# Altium schematic sheet BBeams.SchDoc: Boosted Beams
size A4; Date: 4/20/2020; Author: Dawson Moore; DrawnBy: Dawson Moore; Engineer: Dawson Moore; Organization: Boosted Legacy; DocumentNumber: 1; Revision: 1.3; SheetNumber: 1; SheetTotal: 1
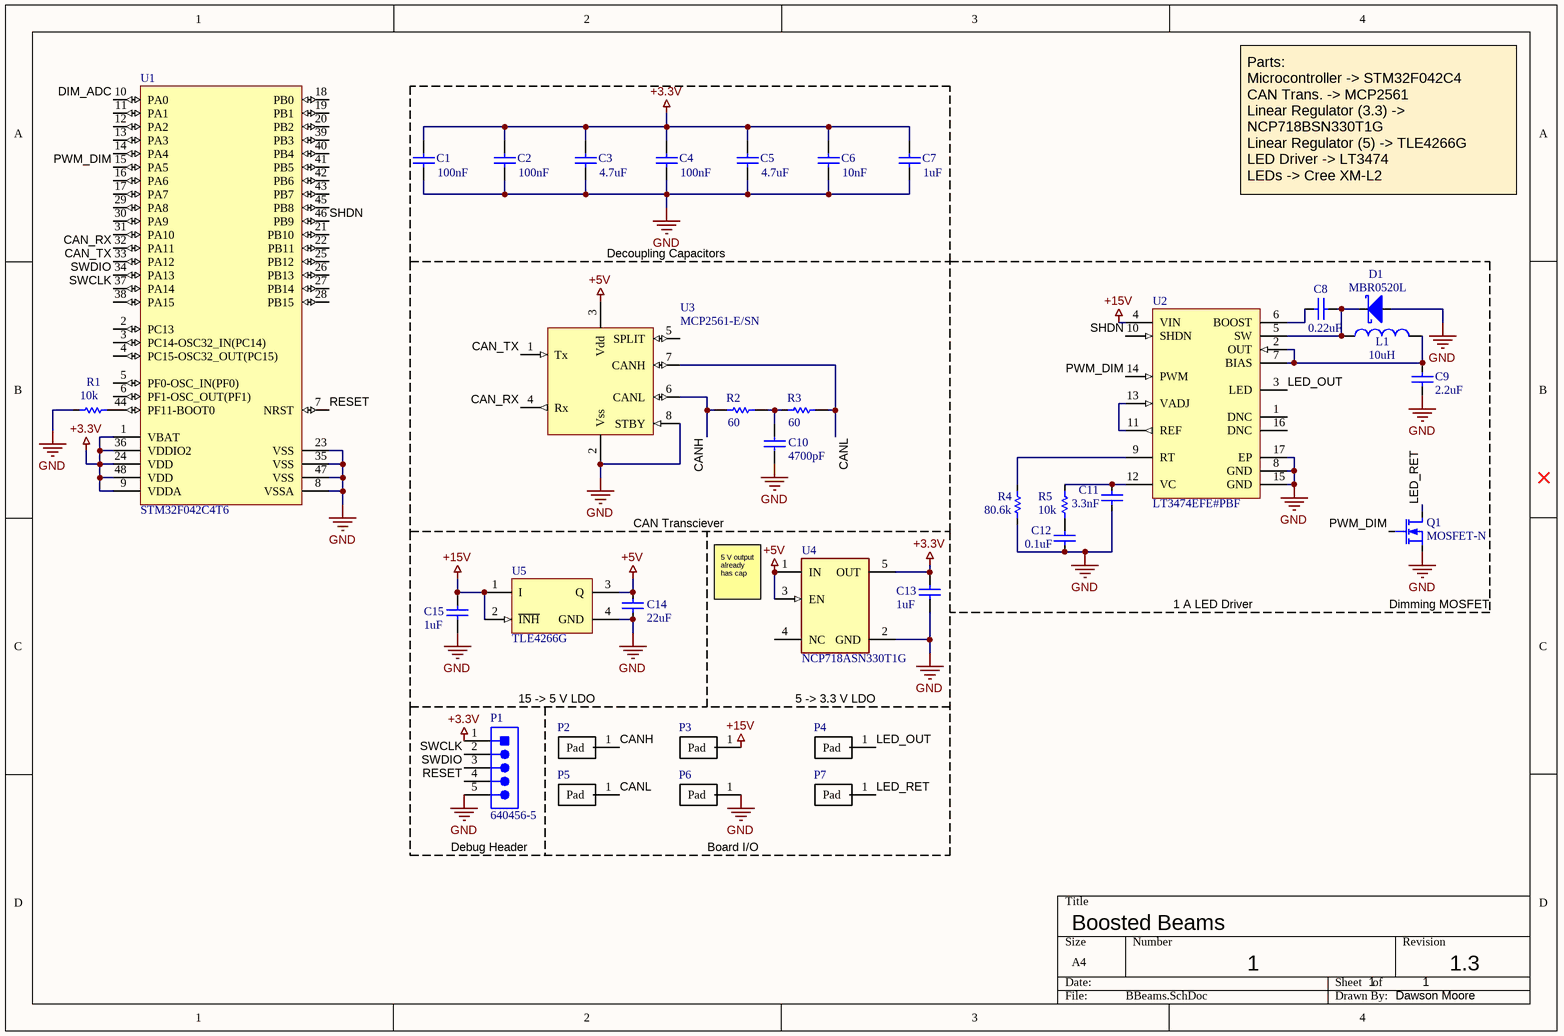
[diagram p0: BBeams.SchDoc]

## Parts
C1  value 100nF  [1608[0603]]  (hidden comment: Cap Semi)
C2  value 100nF  [1608[0603]]  (hidden comment: Cap Semi)
C3  value 4.7uF  [1608[0603]]  (hidden comment: Cap Semi)
C4  value 100nF  [1608[0603]]  (hidden comment: Cap Semi)
C5  value 4.7uF  [1608[0603]]  (hidden comment: Cap Semi)
C6  value 10nF  [1608[0603]]  (hidden comment: Cap Semi)
C7  value 1uF  [1608[0603]]  (hidden comment: Cap Semi)
C8  value 0.22uF  [1608[0603]]  (hidden comment: Cap Semi)
C9  value 2.2uF  [1608[0603]]  (hidden comment: Cap Semi)
C10  value 4700pF  [1608[0603]]  (hidden comment: Cap Semi)
C11  value 3.3nF  [1608[0603]]  (hidden comment: Cap Semi)
C12  value 0.1uF  [1608[0603]]  (hidden comment: Cap Semi)
C13  value 1uF  [1608[0603]]  (hidden comment: Cap Semi)
C14  value 22uF  [1608[0603]]  (hidden comment: Cap Semi)
C15  value 1uF  [1608[0603]]  (hidden comment: Cap Semi)
D1  MBR0520L  [ONSC-SOD-123-2-425-04_V]
L1  value 10uH  [1608[0603]]  (hidden comment: Inductor)
P1  640456-5  [TECO-640456-5]
P2  I/O Pad  [I/O Pad]  (value not drawn)
P3  I/O Pad  [I/O Pad]  (value not drawn)
P4  I/O Pad  [I/O Pad]  (value not drawn)
P5  I/O Pad  [I/O Pad]  (value not drawn)
P6  I/O Pad  [I/O Pad]  (value not drawn)
P7  I/O Pad  [I/O Pad]  (value not drawn)
Q1  MOSFET-N  [SOT-23_N]
R1  value 10k  [1608[0603]]  (hidden comment: Res1)
R2  value 60  [1608[0603]]  (hidden comment: Res1)
R3  value 60  [1608[0603]]  (hidden comment: Res1)
R4  value 80.6k  [1608[0603]]  (hidden comment: Res1)
R5  value 10k  [1608[0603]]  (hidden comment: Res1)
U1  STM32F042C4T6  [STM-LQFP48_M]
U2  LT3474EFE#PBF  [LT-FE-16-EPV-BA_N]
U3  MCP2561-E/SN  [SO8_L]
U4  NCP718ASN330T1G  [FP-419AE-01-IPC_C]
U5  TLE4266G  [INF-PG-SOT223_SC-73_N]

## Blocks framed on the sheet
Decoupling Capacitors: C1-C7

## Nets
+3.3V: C1.2 C2.2 C3.2 C4.2 C5.2 C6.2 C7.2 C13.2 P1.1(DTR) U1.1(VBAT) U1.9(VDDA) U1.24(VDD) U1.36(VDDIO2) U1.48(VDD) U4.5(OUT)
+5V: C14.2 U3.3(Vdd) U4.1(IN) U4.3(EN) U5.3(Q)
+15V: C15.2 P3.1(Pad) U2.4(VIN) U5.1(I) U5.2(~{INH})
GND: C1.1 C2.1 C3.1 C4.1 C5.1 C6.1 C7.1 C9.2 C10.1 C11.1 C12.1 C13.1 C14.1 C15.1 D1.2(A) P1.5(CTS) P6.1(Pad) Q1.3(S) R1.2 R4.1 U1.8(VSSA) U1.23(VSS) U1.35(VSS) U1.47(VSS) U2.8(GND) U2.15(GND) U2.17(EP) U3.2(Vss) U3.8(STBY) U4.2(GND) U5.4(GND)
CAN_RX: U1.32(PA11) U3.4(Rx)
CAN_TX: U1.33(PA12) U3.1(Tx)
CANH: P2.1(Pad) R2.1 U3.6(CANL)
CANL: P5.1(Pad) R3.2 U3.7(CANH)
LED_OUT: P4.1(Pad) U2.3(LED)
LED_RET: P7.1(Pad) Q1.1(D)
PWM_DIM: Q1.2(G) U1.15(PA5) U2.14(PWM)
RESET: P1.4(VCC) U1.7(NRST)
SHDN: U1.46(PB9) U2.10(SHDN)
SWCLK: P1.2(RXI) U1.37(PA14)
SWDIO: P1.3(TXO) U1.34(PA13)
NetC8_1: C8.1 D1.1(K) L1.1 U2.5(SW)
NetC8_2: C8.2 U2.6(BOOST)
NetC9_1: C9.1 L1.2 U2.2(OUT) U2.7(BIAS)
NetC10_2: C10.2 R2.2 R3.1
NetC11_2: C11.2 R5.2 U2.12(VC)
NetC12_2: C12.2 R5.1
NetR1_1: R1.1 U1.44(PF11-BOOT0)
NetR4_2: R4.2 U2.9(RT)
NetU2_11: U2.11(REF) U2.13(VADJ)

Not connected (* = marked no-connect by the designer): U1 2(PC13) 3(PC14-OSC32_IN(PC14)) 4(PC15-OSC32_OUT(PC15)) 5(PF0-OSC_IN(PF0)) 6(PF1-OSC_OUT(PF1)) 10(PA0) 11(PA1) 12(PA2) 13(PA3) 14(PA4) 16(PA6) 17(PA7) 18(PB0) 19(PB1) 20(PB2) 21(PB10) 22(PB11) 25(PB12) 26(PB13) 27(PB14) 28(PB15) 29(PA8) 30(PA9) 31(PA10) 38(PA15) 39(PB3) 40(PB4) 41(PB5) 42(PB6) 43(PB7) 45(PB8); U2 1(DNC) 16(DNC); U3 5(SPLIT); U4 4(NC)

## Notes on the sheet
- (near U1) DIM_ADC
- Parts:
  Microcontroller -> STM32F042C4
  CAN Trans. -> MCP2561
  Linear Regulator (3.3) -> NCP718BSN330T1G
  Linear Regulator (5) -> TLE4266G
  LED Driver -> LT3474
  LEDs -> Cree XM-L2
  Dimming FET -> PMV16XNR
- CAN Transciever
- (near U4) 5 V output
  already has cap
- 1 A LED Driver
- Dimming MOSFET
- 15 -> 5 V LDO
- 5 -> 3.3 V LDO
- (near P1) Debug Header
- (near P6) Board I/O
- Title
- Size:
- Date:
- A4
- Number:
- Time:
- Revision:
- Sheet
- of
- File:

## Library data of the parts
C1-C15 = Cap Semi: Capacitor (Semiconductor SIM Model); Published: 8-Jun-2000; LatestRevisionDate: 29-May-2009; LatestRevisionNote: IPC-7351 Footprint Added.; PackageReference: C1206; Publisher: Altium Limited; PackageDescription: Chip Capacitor
D1 = CMP-2000-04926-1: Schottky Diode, 20V, 0.2A, 2-pin SOD-123, RoHS, Tape and Reel; Manufacturer: FairchildSemiconductor; Peak Forward Voltage: 0.385V; Rad Hard: No; Peak Non-Repetitive Surge Current: 5.5A; Peak Average Forward Current: 0.5A; Peak Reverse Current: 250uA; Configuration: Single; Mounting: SurfaceMount; Operating Temperature: -65to125degC; Datasheet URL: https://datasheet.ciiva.com/5739/1684450-5739282.pdf; Package Reference: SOD-123-2-425-04; Package Description: 2-Pin Small Outline Diode, Body 2.69 x 1.6 mm; Type: SchottkyDiode; Datasheet Version: Rev. C0, 03/2012; Manufacturer URL: https://www.fairchildsemi.com/; Peak Reverse Repetitive Voltage: 20V; Package: 2SOD-123; Packaging: Tape&Reel; Category: Rectifier
L1 = Inductor: Code_IEC: 1005; Published: 8-Jun-2000; LatestRevisionDate: 29-May-2009; LatestRevisionNote: IPC-7351 Footprint Added.; PackageReference: 0402-A; Publisher: Altium Limited; PackageDescription: Chip Inductor; Code_JEITA: 0402
P1 = CMP-1684-00014-1: Male Header, Pitch 2.54 mm, 1 x 5 Position, Height 10.03 mm, Tail Length 3.56 mm, / -55 to 105 degC, RoHS, Bulk; Manufacturer: TE Connectivity; Material, Housing: Polyester; Brand/Series: MTA-100Series; Color, Housing: White; Current, Rating: 5 / A; Temperature, Operating: -55to+105 / °C; Connector Type: MTA-100; Agency Approvals: CSA,UL; Material, Contact: CopperAlloy; Mounting Hole Size: 0.04 / "; Voltage, Rating: 250 / V; Contact Termination Area Plating: Tin; Pin Spacing: 0.1 / "; Primary Type: InterconnectSystem; Special Features: Pinstrip; Mount Angle: Vertical; Contact Centerline Spacing: 0.100 / in.; Number of Contacts: 5; Standards: RoHSCompliant,ELVCompliant,UL94V-0; Angle: Straight; Length, Terminal Post: 0.14 / in.; Manufacturer URL: http://www.te.com; Flammability Rating: UL94V-0; Mounting Type: PCMount; Termination: Solder; Package Reference: THD; Length, Overall: 0.5 / "; Contact Mating Area Plating: Tin; Length, Pin: 0.14 / "; Datasheet URL: http://sigma.octopart.com/77881742/technical_drawing/TE-Connectivity-640456-5.pdf; Package Description: Male Header, Pitch 2.54 mm, 1 x 5 Position, Height 10.03 mm, Tail Length 3.56 mm; Datasheet Version: Rev. W3; Contact Plating: Tin; Color: White; Number of Positions: 5; Type: PCBPlug; Contact Shape: Square; Number of Rows: 1; Size, Post: 0.025 / in.
Q1 = MOSFET-N: N-Channel MOSFET; Published: 8-Jun-2000; LatestRevisionDate: 17-Jul-2002; LatestRevisionNote: Re-released for DXP Platform.; PackageVersion: 1995/1996; PackageReference: E3; Publisher: Altium Limited; PackageDescription: TO, Flat Index; 3 In-Line, Axial Leads; Body Dia. 4.6mm; Lead Dia. 0.5 mm (max)
R1-R5 = Res1: Resistor; Published: 8-Jun-2000; LatestRevisionDate: 17-Jul-2002; LatestRevisionNote: Re-released for DXP Platform.; PackageReference: AXIAL-0.3; Publisher: Altium Limited; PackageDescription: Axial Device, Thru-Hole; 2 Leads; 0.3 in Pin Spacing
U1 = CMP-0304-00102-2: ARM Cortex-M0 32-bit MCU, 16 KB Flash, 6 KB Internal RAM, 38 I/Os, 48-Pin LQFP, -40 to 85 degC, Tray; Manufacturer: STMicroelectronics; Operating Frequency(F) (Processor speed) (MHz): 48; FLASH Size (Prog) (kB): 16; Internal RAM Size (kB): 6; I/Os (High Current): 38; Supply Voltage(Vcc) min (V): 2; ComponentLink1Description: Manufacturer URL; Packing: Tray; ComponentLink2Description: Datasheet; ComponentLink2URL: http://www.st.com/st-web-ui/static/active/en/resource/technical/document/datasheet/DM00105814.pdf; DatasheetVersion: Rev. 5; ComponentLink1URL: http://www.st.com/; Package Reference: LQFP48; Mounting Technology: Surface Mount; Package Description: 48-Pin Low Profile Quad Flat Package, Body 7 x 7 mm, Pitch 0.5 mm; Core: ARM Cortex-M0; PartNumber: STM32F042C4T6
U2 = CMP-0477-00086-1: Step-Down 1 A LED Driver with Open Circuit Protection, 4 to 36 V Vin, 15 V Vout MAX, 16-pin SOP (FE-16-EPV-BA), -40 to 85 degC, Pb-Free; Manufacturer: Linear Technology; Vin Min(V): 4; Topology: Buck, LED Driver; ComponentLink1Description: Manufacturer URL; ComponentLink2Description: Datasheet; ComponentLink3URL: http://cds.linear.com/docs/en/packaging/05081663_J_FE16(BA).pdf; Mounting Technology: Surface Mount; DatasheetVersion: Rev. D; PackageVersion: Rev. I, 05/2011; ComponentLink3Description: Package Specification; ComponentLink2URL: http://cds.linear.com/docs/en/datasheet/3474fd.pdf; PackageReference: FE-16; RoHS: TRUE; PartNumber: LT3474EFE#PBF; PackageDescription: 16-Pin Plastic TSSOP, Body 5 x 4.4 mm, Pitch 0.65 mm; ComponentLink1URL: http://www.linear.com/
U4 = CMP-07128-000009-1: 300 MA LOW IQ WIDE INPUT; Manufacturer: ON Semiconductor; Output Current: 800mA; Accuracy Percentage: 2%; Max Junction Temp: +150°C; Standoff Height: 0.01mm; Number Of Outputs: 1; Nominal Supply Current: 4uA; Max Supply Voltage: 24V; Min Supply Voltage: 2.5V; Output Type: Fixed; Output Voltage: 3.3V; Dropout Voltage: 275mV; Octopart: https://octopart.com/ncp718asn330t1g-on+semiconductor-87658778; Category: IC; Mouser Description: LDO Regulator, 300 mA, Wide Vin, Ultra-Low Iq Fixed 3.3V, Active Discharge, TSOT23-5; ComponentLink2Description: Datasheet; Height: 1mm; Device Class L2: Power Management ICs; Device Class L1: Integrated Circuits (ICs); ComponentLink2URL: https://www.onsemi.com/pub/Collateral/NCP718-D.PDF; Lead Free: Yes; Ipc Land Pattern Name: SOT95P280X100-5; Temperature Range High: +150°C; Device Class L3: Voltage Regulators - Linear; Package: 419AE-01; Digikey Description: 300 MA LOW IQ WIDE INPUT; Footprint Url: https://www.onsemi.com/pub/Collateral/419AE.PDF; Manufacturer Part Number: NCP718ASN330T1G; Automotive: No; Temperature: to +150°C; RoHS: TRUE
U5 = CMP-1109-00078-1: 5 V Low Drop Voltage Regulator, 5.5 to 45 V Supply, -40 to 150 degC, PG-SOT223 (SC-73), Reel, Green; Manufacturer: Infineon; Accuracy: 2 %; Output Voltage: 5V; Green: TRUE; Regulator Type: single output; Typical Quiescent Current: 300 uA; Dropout Voltage: 250 mV; Max. Output Current: 100 mA; ComponentLink3Description: Package Specification; ComponentLink1Description: Manufacturer URL; ComponentLink2URL: http://www.infineon.com/dgdl/TLE4266_DS_25%5B1%5D.pdf?folderId=db3a30431be39b97011c1dfc76d7781d&fileId=db3a30431be39b97011c1dfda483781e&location=en.Products.Automotive_ICs.Linear_Voltage_Regulators_for_Automotive-Applications.Linear_Voltage_Regulators_-_Se; PackageDescription: 4-Pin Small Outline Transistor Package, 6.5 x 3.5 mm Body, 2.3 mm Pitch; PackageVersion: Apr-08; Operating Range: 5.5 to 45 V; ComponentLink2Description: Datasheet; DatasheetVersion: Rev. 2.5; PackageReference: PG-SOT223 (SC-73); Packing: Reel; Mounting Technology: Surface Mount; ComponentLink1URL: http://www.infineon.com/; PartNumber: TLE4266G; ComponentLink3URL: http://www.infineon.com/dgdl/SOT223-Package_Overview.pdf?folderId=db3a30431936bc4b0119530470b03c3d&fileId=db3a30431936bc4b0119531d40b93c5c